# Altium schematic sheet Customer_Module-Main_Sheet.SchDoc
size A4
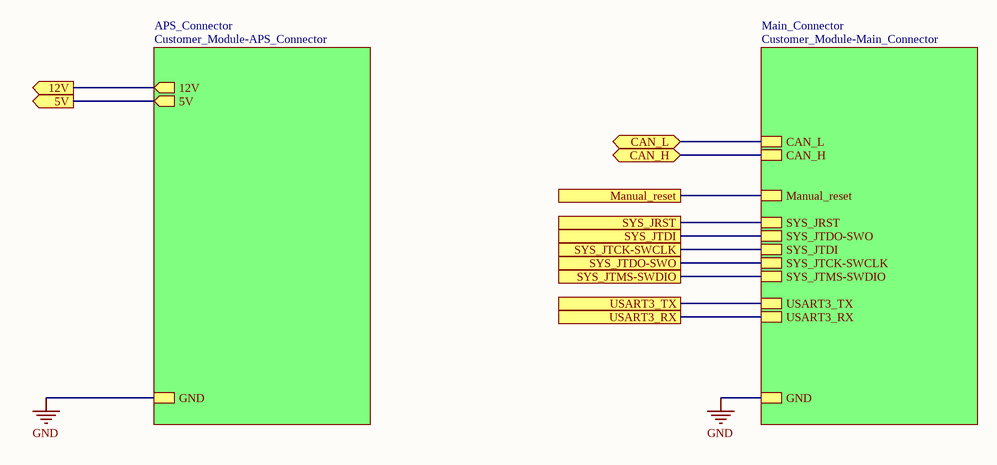
[diagram p0: Customer_Module-Main_Sheet.SchDoc]

## Sub-sheets
APS_Connector = Customer_Module-APS_Connector: GND, 12V (out), 5V (out)
Main_Connector = Customer_Module-Main_Connector: GND, CAN_L, CAN_H, SYS_JRST, SYS_JTDO-SWO, SYS_JTDI, SYS_JTCK-SWCLK, SYS_JTMS-SWDIO, USART3_TX, USART3_RX, Manual_reset

## Ports
5V (out), 12V (out), CAN_H (bidir), CAN_L (bidir), Manual_reset, SYS_JRST, SYS_JTCK-SWCLK, SYS_JTDI, SYS_JTDO-SWO, SYS_JTMS-SWDIO, USART3_RX, USART3_TX

## Nets
GND: sheet Main_Connector/GND, sheet APS_Connector/GND
5V: port 5V, sheet APS_Connector/5V
12V: port 12V, sheet APS_Connector/12V
CAN_H: port CAN_H, sheet Main_Connector/CAN_H
CAN_L: port CAN_L, sheet Main_Connector/CAN_L
Manual_reset: port Manual_reset, sheet Main_Connector/Manual_reset
SYS_JRST: port SYS_JRST, sheet Main_Connector/SYS_JRST
SYS_JTCK-SWCLK: port SYS_JTCK-SWCLK, sheet Main_Connector/SYS_JTDI
SYS_JTDI: port SYS_JTDI, sheet Main_Connector/SYS_JTDO-SWO
SYS_JTDO-SWO: port SYS_JTDO-SWO, sheet Main_Connector/SYS_JTCK-SWCLK
SYS_JTMS-SWDIO: port SYS_JTMS-SWDIO, sheet Main_Connector/SYS_JTMS-SWDIO
USART3_RX: port USART3_RX, sheet Main_Connector/USART3_RX
USART3_TX: port USART3_TX, sheet Main_Connector/USART3_TX